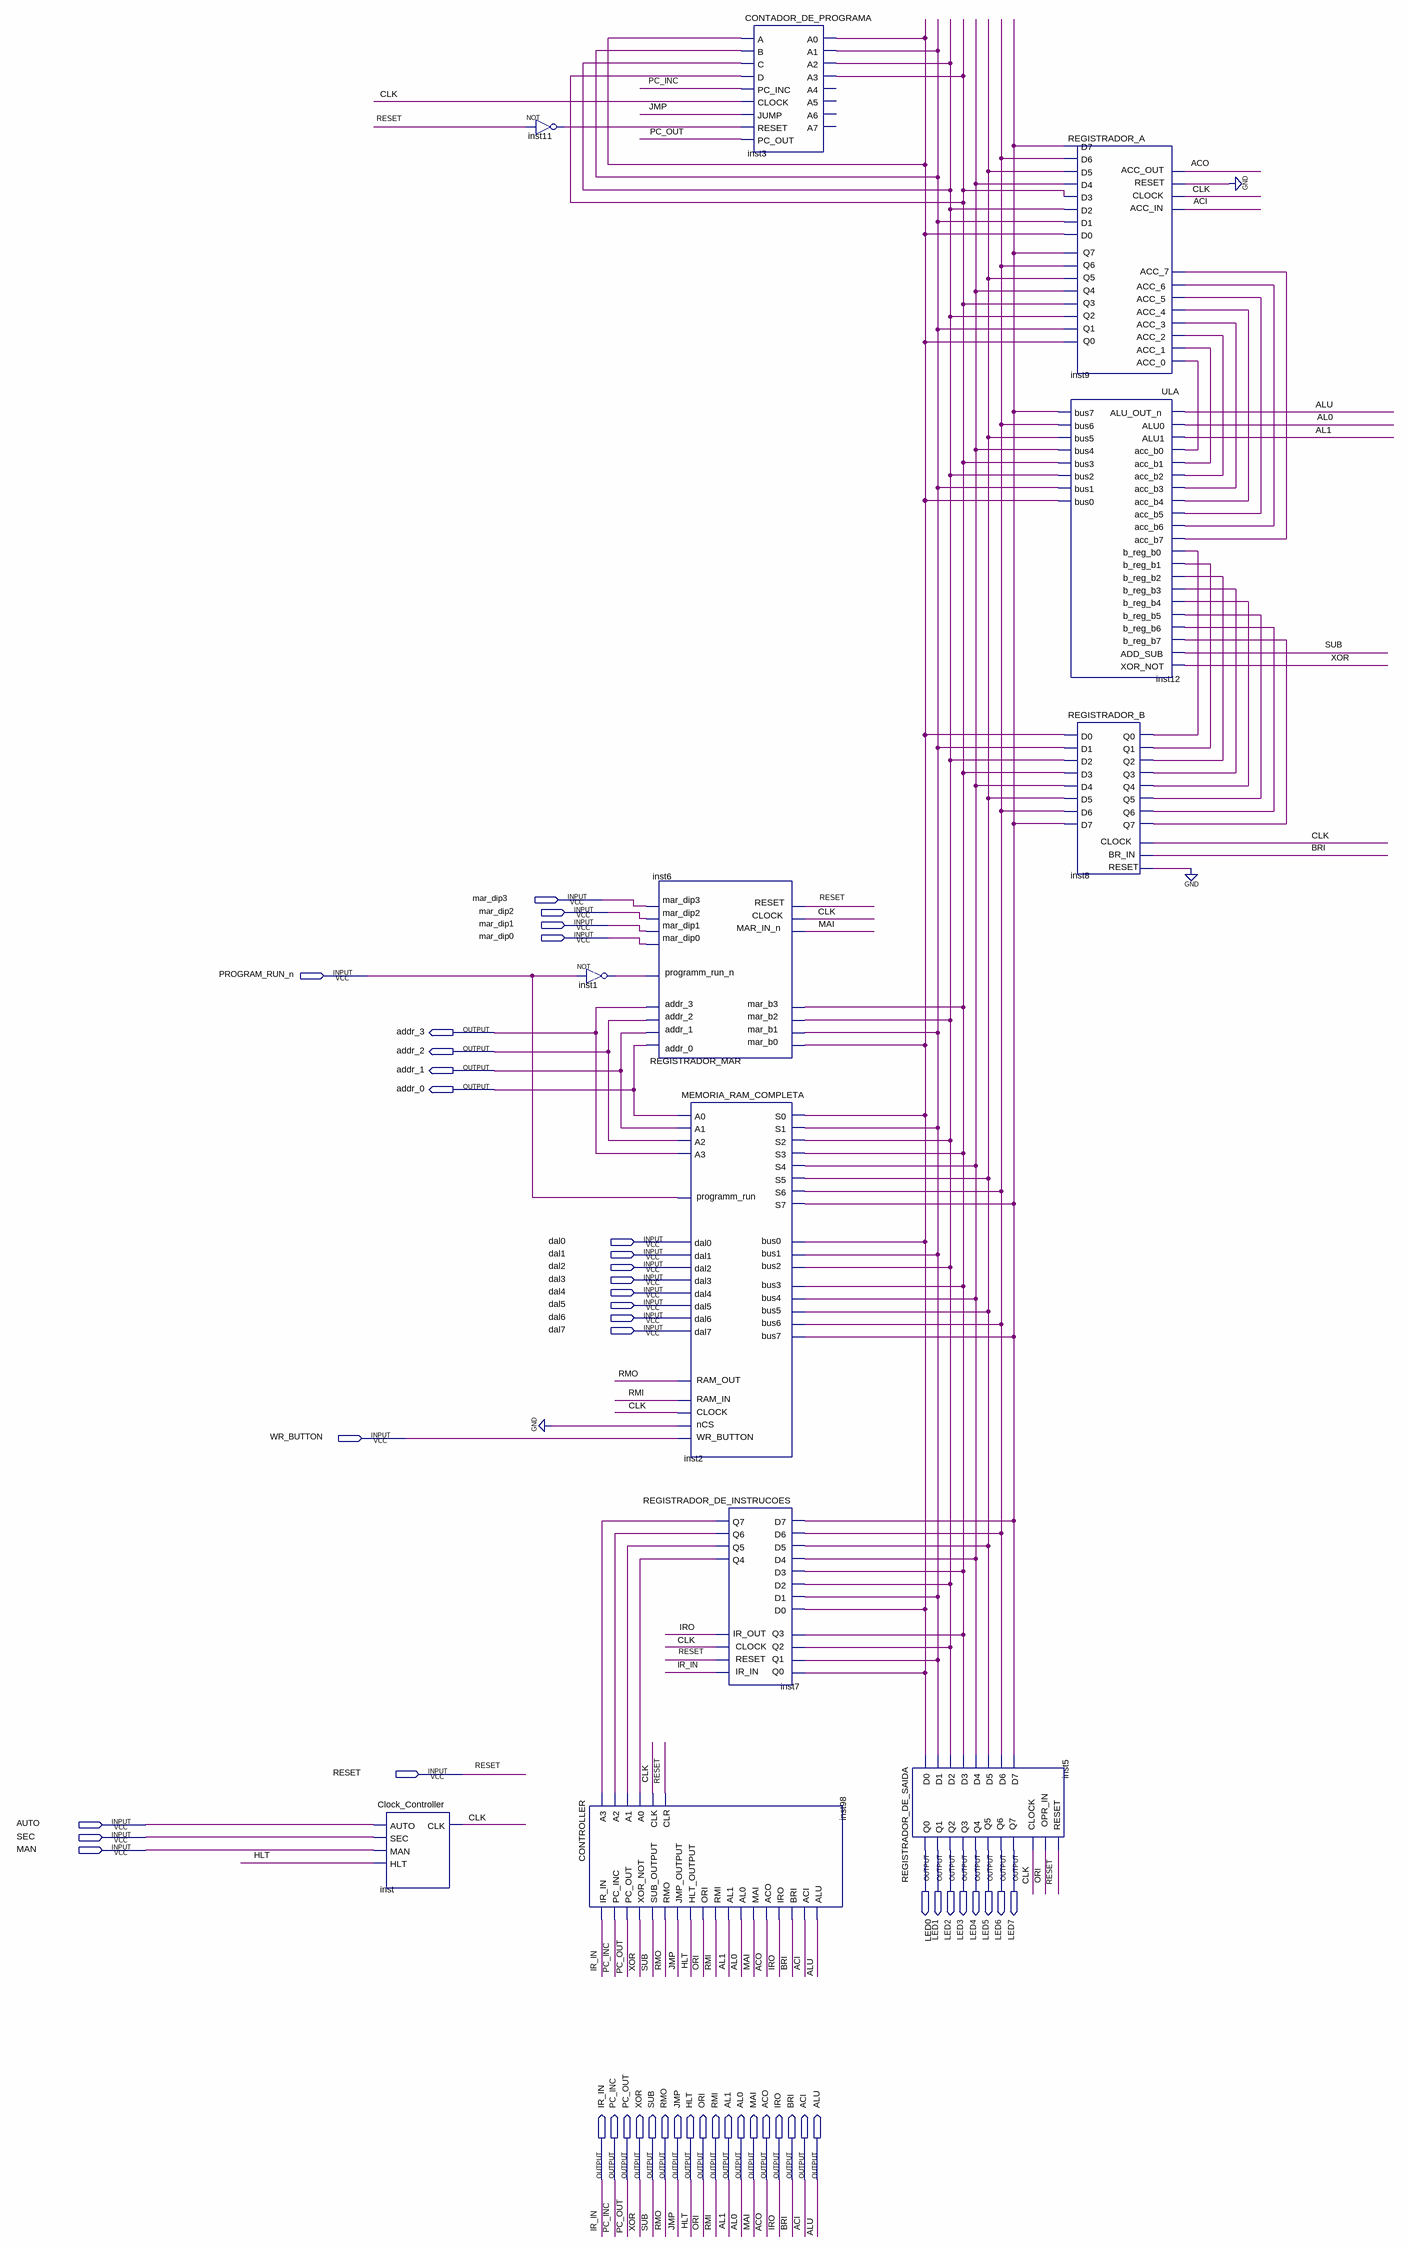
[diagram p0: schematic sheet]
// Quartus schematic SAP.bdf as structural Verilog: 12 symbols, 48 pins
module SAP (
  input  mar_dip3,
  input  mar_dip2,
  input  mar_dip1,
  input  mar_dip0,
  input  PROGRAM_RUN_n,
  input  dal0,
  input  dal1,
  input  dal2,
  input  dal3,
  input  dal4,
  input  dal5,
  input  dal6,
  input  dal7,
  input  WR_BUTTON,
  input  RESET,
  input  AUTO,
  input  SEC,
  input  MAN,
  output addr_3,
  output addr_2,
  output addr_1,
  output addr_0,
  output LED0,
  output LED1,
  output LED2,
  output LED3,
  output LED4,
  output LED5,
  output LED6,
  output LED7,
  output IR_IN,
  output PC_INC,
  output PC_OUT,
  output XOR,
  output SUB,
  output RMO,
  output JMP,
  output HLT,
  output ORI,
  output RMI,
  output AL1,
  output AL0,
  output MAI,
  output ACO,
  output IRO,
  output BRI,
  output ACI,
  output ALU
);

  wire CLK, inst1_out, inst2_s0, inst2_s1, inst2_s2, inst2_s3, inst2_s4, inst2_s5, inst2_s6, inst2_s7,
       inst7_q4, inst7_q5, inst7_q6, inst7_q7, inst8_q0, inst8_q1, inst8_q2, inst8_q3, inst8_q4, inst8_q5,
       inst8_q6, inst8_q7, inst9_acc_0, inst9_acc_1, inst9_acc_2, inst9_acc_3, inst9_acc_4, inst9_acc_5,
       inst9_acc_6, inst9_acc_7, inst11_out;

  Clock_Controller inst (.AUTO(AUTO), .SEC(SEC), .MAN(MAN), .HLT(HLT), .CLK(CLK));
  not inst11 (inst11_out, RESET);
  not inst1 (inst1_out, PROGRAM_RUN_n);
  CONTROLLER inst98 (
    .A3(inst7_q7), .A2(inst7_q6), .A1(inst7_q5), .A0(inst7_q4), .CLK(CLK), .CLR(RESET), .IR_IN(IR_IN),
    .PC_INC(PC_INC), .PC_OUT(PC_OUT), .XOR_NOT(XOR), .SUB_OUTPUT(SUB), .RMO(RMO), .JMP_OUTPUT(JMP),
    .HLT_OUTPUT(HLT), .ORI(ORI), .RMI(RMI), .AL1(AL1), .AL0(AL0), .MAI(MAI), .ACO(ACO), .IRO(IRO), .BRI(BRI),
    .ACI(ACI), .ALU(ALU));
  REGISTRADOR_MAR inst6 (
    .programm_run_n(inst1_out), .mar_b3(inst2_s3), .mar_b2(inst2_s2), .mar_b1(inst2_s1), .mar_dip3(mar_dip3),
    .mar_b0(inst2_s0), .mar_dip2(mar_dip2), .MAR_IN_n(MAI), .CLOCK(CLK), .mar_dip1(mar_dip1), .RESET(RESET),
    .mar_dip0(mar_dip0), .addr_3(addr_3), .addr_2(addr_2), .addr_1(addr_1), .addr_0(addr_0));
  MEMORIA_RAM_COMPLETA inst2 (
    .dal7(dal7), .bus7(inst2_s7), .A0(addr_0), .dal6(dal6), .A1(addr_1), .bus6(inst2_s6), .A2(addr_2),
    .dal5(dal5), .A3(addr_3), .bus5(inst2_s5), .programm_run(PROGRAM_RUN_n), .nCS(1'b0), .dal4(dal4),
    .bus4(inst2_s4), .RAM_IN(RMI), .CLOCK(CLK), .dal3(dal3), .bus3(inst2_s3), .dal2(dal2),
    .WR_BUTTON(WR_BUTTON), .bus2(inst2_s2), .dal1(dal1), .bus1(inst2_s1), .dal0(dal0), .bus0(inst2_s0),
    .RAM_OUT(RMO), .S0(inst2_s0), .S1(inst2_s1), .S2(inst2_s2), .S3(inst2_s3), .S4(inst2_s4), .S5(inst2_s5),
    .S6(inst2_s6), .S7(inst2_s7));
  CONTADOR_DE_PROGRAMA inst3 (
    .A(inst2_s0), .B(inst2_s1), .C(inst2_s2), .D(inst2_s3), .PC_INC(PC_INC), .CLOCK(CLK), .JUMP(JMP),
    .RESET(inst11_out), .PC_OUT(PC_OUT), .A0(inst2_s0), .A1(inst2_s1), .A2(inst2_s2), .A3(inst2_s3));  // open: A4, A5, A6, A7
  REGISTRADOR_DE_INSTRUCOES inst7 (
    .D7(inst2_s7), .D6(inst2_s6), .D5(inst2_s5), .D4(inst2_s4), .CLOCK(CLK), .RESET(RESET), .D3(inst2_s3),
    .D2(inst2_s2), .D1(inst2_s1), .D0(inst2_s0), .IR_IN(IR_IN), .IR_OUT(IRO), .Q7(inst7_q7), .Q6(inst7_q6),
    .Q5(inst7_q5), .Q4(inst7_q4), .Q3(inst2_s3), .Q2(inst2_s2), .Q1(inst2_s1), .Q0(inst2_s0));
  REGISTRADOR_DE_SAIDA inst5 (
    .D7(inst2_s7), .D6(inst2_s6), .D5(inst2_s5), .D4(inst2_s4), .CLOCK(CLK), .RESET(RESET), .D3(inst2_s3),
    .D2(inst2_s2), .D1(inst2_s1), .D0(inst2_s0), .OPR_IN(ORI), .Q7(LED7), .Q6(LED6), .Q5(LED5), .Q4(LED4),
    .Q3(LED3), .Q2(LED2), .Q1(LED1), .Q0(LED0));
  REGISTRADOR_A inst9 (
    .D7(inst2_s7), .D6(inst2_s6), .D5(inst2_s5), .D4(inst2_s4), .CLOCK(CLK), .RESET(1'b0), .ACC_IN(ACI),
    .D3(inst2_s3), .D2(inst2_s2), .D1(inst2_s1), .D0(inst2_s0), .ACC_OUT(ACO), .ACC_7(inst9_acc_7),
    .ACC_6(inst9_acc_6), .ACC_5(inst9_acc_5), .ACC_4(inst9_acc_4), .Q7(inst2_s7), .Q6(inst2_s6),
    .Q5(inst2_s5), .Q4(inst2_s4), .Q3(inst2_s3), .Q2(inst2_s2), .Q1(inst2_s1), .Q0(inst2_s0),
    .ACC_3(inst9_acc_3), .ACC_2(inst9_acc_2), .ACC_1(inst9_acc_1), .ACC_0(inst9_acc_0));
  ULA inst12 (
    .ALU_OUT_n(ALU), .ALU0(AL0), .ALU1(AL1), .acc_b0(inst9_acc_0), .acc_b1(inst9_acc_1),
    .acc_b2(inst9_acc_2), .acc_b3(inst9_acc_3), .acc_b4(inst9_acc_4), .acc_b5(inst9_acc_5),
    .acc_b6(inst9_acc_6), .acc_b7(inst9_acc_7), .b_reg_b0(inst8_q0), .b_reg_b1(inst8_q1),
    .b_reg_b2(inst8_q2), .b_reg_b3(inst8_q3), .b_reg_b4(inst8_q4), .b_reg_b5(inst8_q5), .b_reg_b6(inst8_q6),
    .b_reg_b7(inst8_q7), .ADD_SUB(SUB), .XOR_NOT(XOR), .bus7(inst2_s7), .bus6(inst2_s6), .bus5(inst2_s5),
    .bus4(inst2_s4), .bus3(inst2_s3), .bus2(inst2_s2), .bus1(inst2_s1), .bus0(inst2_s0));
  REGISTRADOR_B inst8 (
    .D1(inst2_s1), .D2(inst2_s2), .D3(inst2_s3), .CLOCK(CLK), .D4(inst2_s4), .D5(inst2_s5), .D6(inst2_s6),
    .D7(inst2_s7), .BR_IN(BRI), .RESET(1'b0), .D0(inst2_s0), .Q0(inst8_q0), .Q1(inst8_q1), .Q2(inst8_q2),
    .Q3(inst8_q3), .Q4(inst8_q4), .Q5(inst8_q5), .Q6(inst8_q6), .Q7(inst8_q7));
endmodule
